# Altium schematic sheet jmb575.SchDoc
size A2; SheetNumber: 3; SheetTotal: 4
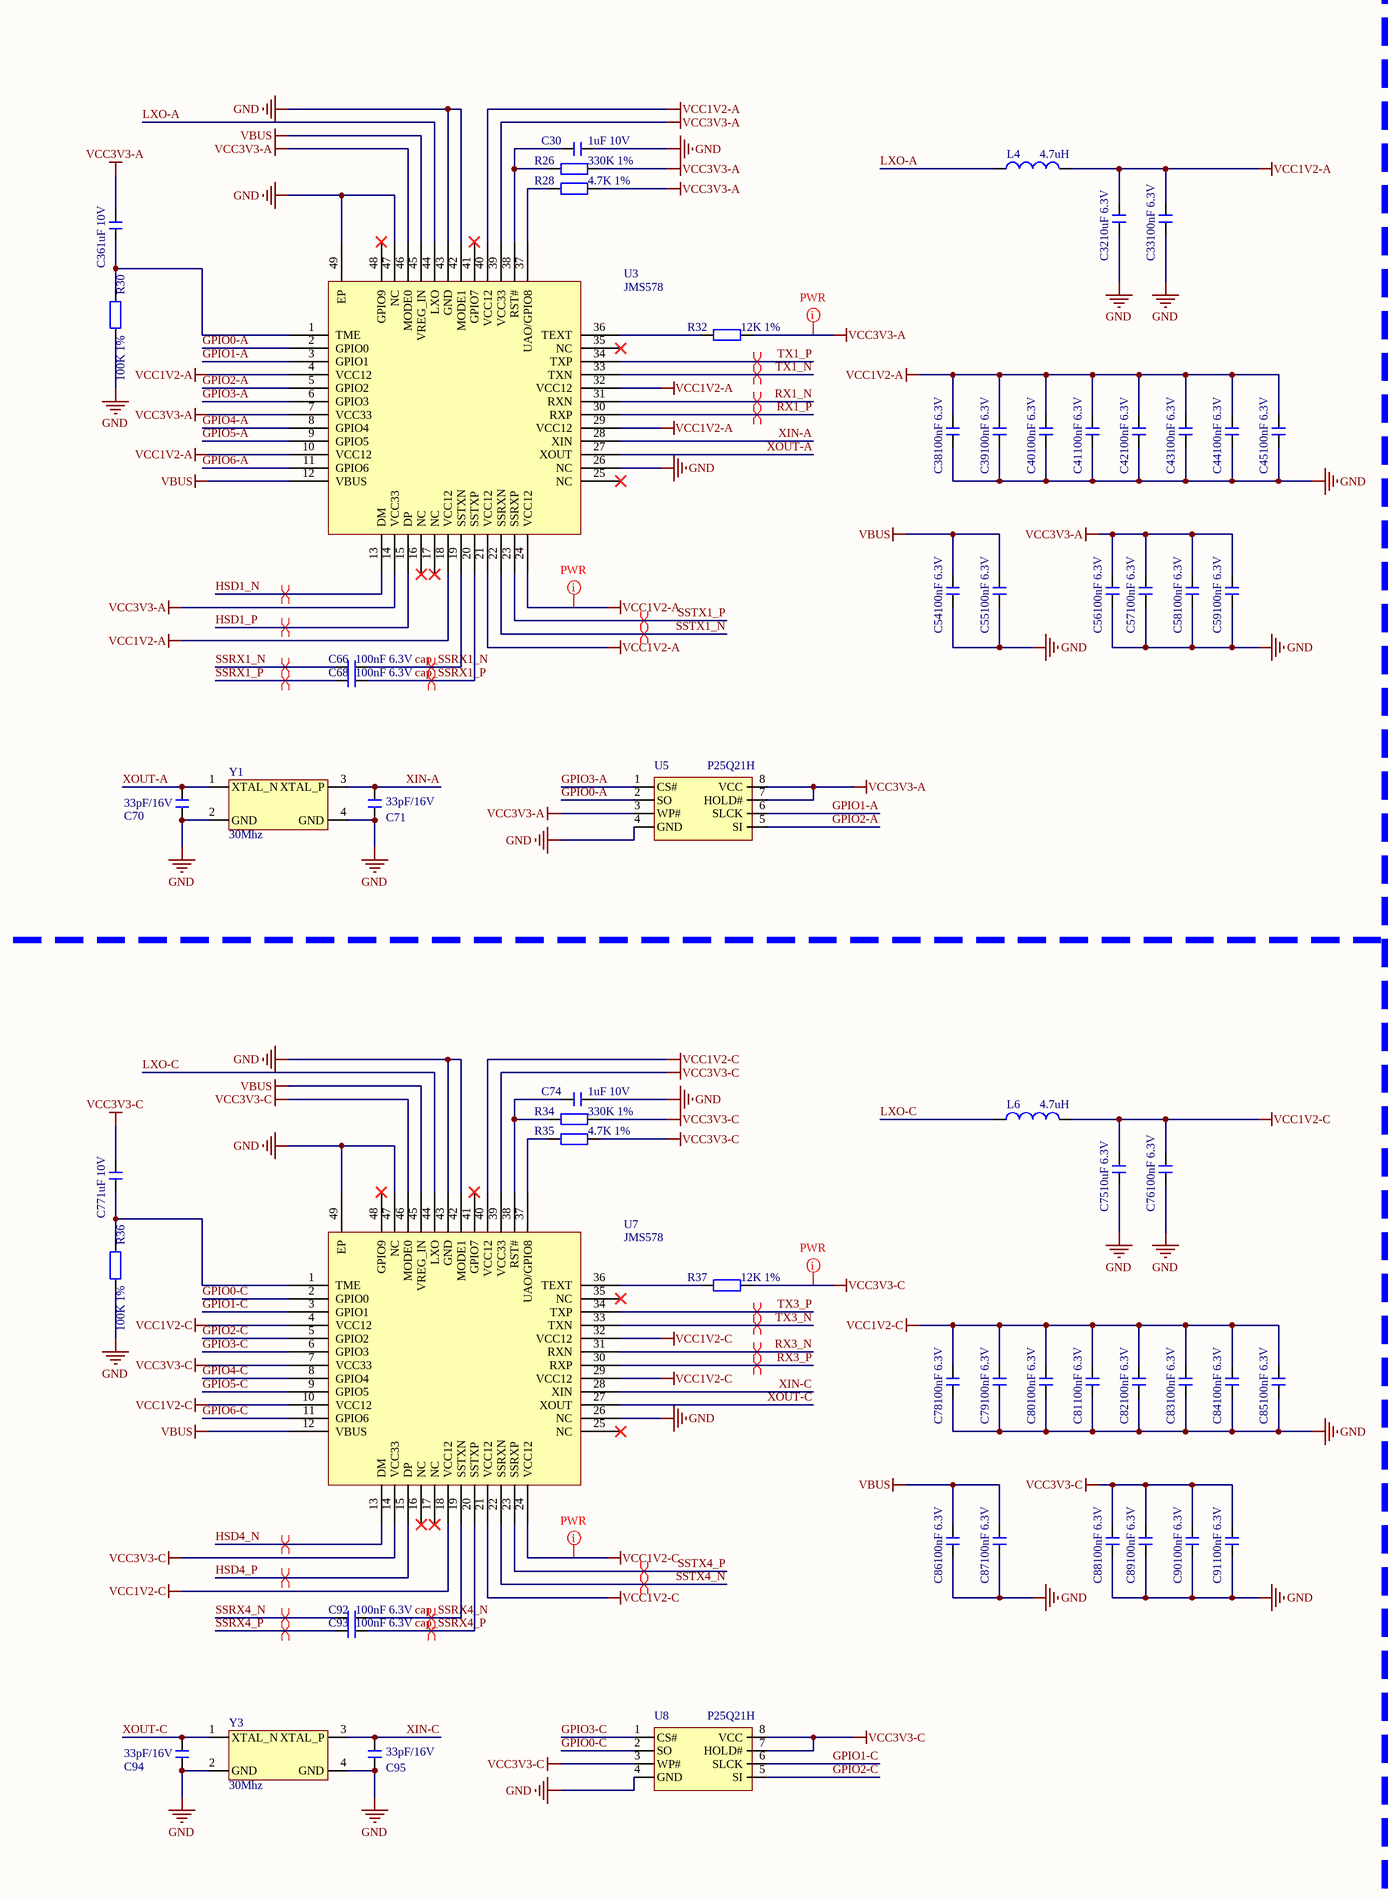
[diagram p0: jmb575.SchDoc, left]
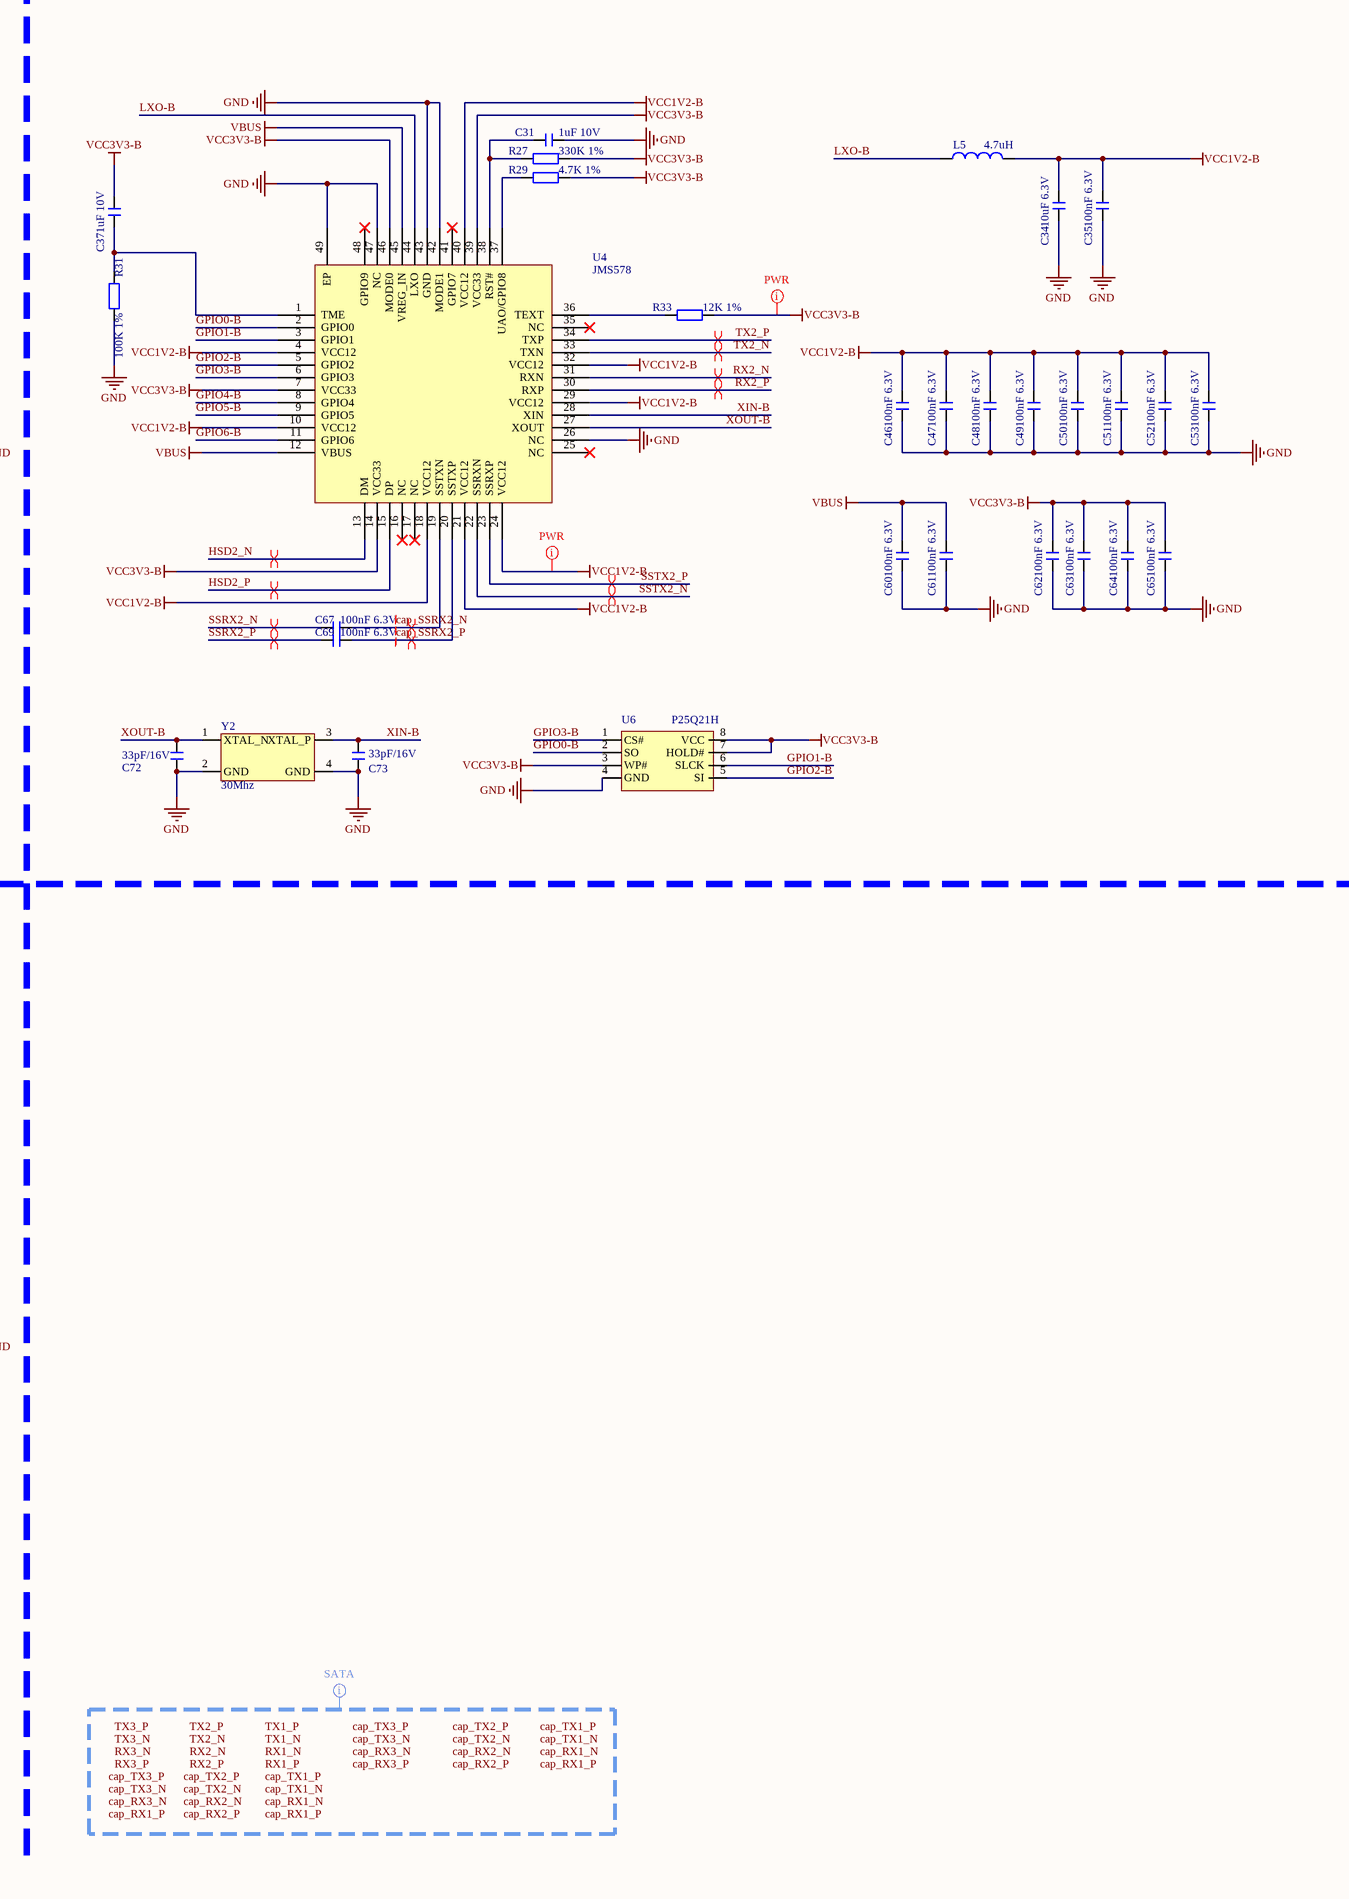
[diagram p1: jmb575.SchDoc, right]

## Parts
C30  1uF 10V  [C0402_L]
C31  1uF 10V  [C0402_L]
C32  10uF 6.3V  [C0603_L]
C33  100nF 6.3V  [C0402_L]
C34  10uF 6.3V  [C0603_L]
C35  100nF 6.3V  [C0402_L]
C36  1uF 10V  [C0402_L]
C37  1uF 10V  [C0402_L]
C38  100nF 6.3V  [C0402_L]
C39  100nF 6.3V  [C0402_L]
C40  100nF 6.3V  [C0402_L]
C41  100nF 6.3V  [C0402_L]
C42  100nF 6.3V  [C0402_L]
C43  100nF 6.3V  [C0402_L]
C44  100nF 6.3V  [C0402_L]
C45  100nF 6.3V  [C0402_L]
C46  100nF 6.3V  [C0402_L]
C47  100nF 6.3V  [C0402_L]
C48  100nF 6.3V  [C0402_L]
C49  100nF 6.3V  [C0402_L]
C50  100nF 6.3V  [C0402_L]
C51  100nF 6.3V  [C0402_L]
C52  100nF 6.3V  [C0402_L]
C53  100nF 6.3V  [C0402_L]
C54  100nF 6.3V  [C0402_L]
C55  100nF 6.3V  [C0402_L]
C56  100nF 6.3V  [C0402_L]
C57  100nF 6.3V  [C0402_L]
C58  100nF 6.3V  [C0402_L]
C59  100nF 6.3V  [C0402_L]
C60  100nF 6.3V  [C0402_L]
C61  100nF 6.3V  [C0402_L]
C62  100nF 6.3V  [C0402_L]
C63  100nF 6.3V  [C0402_L]
C64  100nF 6.3V  [C0402_L]
C65  100nF 6.3V  [C0402_L]
C66  100nF 6.3V  [C0402_L]
C67  100nF 6.3V  [C0402_L]
C68  100nF 6.3V  [C0402_L]
C69  100nF 6.3V  [C0402_L]
C70  33pF/16V  [C0402_L]
C71  33pF/16V  [C0402_L]
C72  33pF/16V  [C0402_L]
C73  33pF/16V  [C0402_L]
C74  1uF 10V  [C0402_L]
C75  10uF 6.3V  [C0603_L]
C76  100nF 6.3V  [C0402_L]
C77  1uF 10V  [C0402_L]
C78  100nF 6.3V  [C0402_L]
C79  100nF 6.3V  [C0402_L]
C80  100nF 6.3V  [C0402_L]
C81  100nF 6.3V  [C0402_L]
C82  100nF 6.3V  [C0402_L]
C83  100nF 6.3V  [C0402_L]
C84  100nF 6.3V  [C0402_L]
C85  100nF 6.3V  [C0402_L]
C86  100nF 6.3V  [C0402_L]
C87  100nF 6.3V  [C0402_L]
C88  100nF 6.3V  [C0402_L]
C89  100nF 6.3V  [C0402_L]
C90  100nF 6.3V  [C0402_L]
C91  100nF 6.3V  [C0402_L]
C92  100nF 6.3V  [C0402_L]
C93  100nF 6.3V  [C0402_L]
C94  33pF/16V  [C0402_L]
C95  33pF/16V  [C0402_L]
L4  4.7uH  [NR2520]
L5  4.7uH  [NR2520]
L6  4.7uH  [NR2520]
R26  330K 1%  [R0402_L]
R27  330K 1%  [R0402_L]
R28  4.7K 1%  [R0402_L]
R29  4.7K 1%  [R0402_L]
R30  100K 1%  [R0402_L]
R31  100K 1%  [R0402_L]
R32  12K 1%  [R0402_L]
R33  12K 1%  [R0402_L]
R34  330K 1%  [R0402_L]
R35  4.7K 1%  [R0402_L]
R36  100K 1%  [R0402_L]
R37  12K 1%  [R0402_L]
U3  JMS578  [QFN48-L6.0-W6.0-P0.4]
U4  JMS578  [QFN48-L6.0-W6.0-P0.4]
U5  P25Q21H  [SOP8_L]
U6  P25Q21H  [SOP8_L]
U7  JMS578  [QFN48-L6.0-W6.0-P0.4]
U8  P25Q21H  [SOP8_L]
Y1  30Mhz  [OSC 3225-4P]
Y2  30Mhz  [OSC 3225-4P]
Y3  30Mhz  [OSC 3225-4P]

## Nets
GND: C30.1 C31.1 C32.1 C33.1 C34.1 C35.1 C38.1 C39.1 C40.1 C41.1 C42.1 C43.1 C44.1 C45.1 C46.1 C47.1 C48.1 C49.1 C50.1 C51.1 C52.1 C53.1 C54.1 C55.1 C56.1 C57.1 C58.1 C59.1 C60.1 C61.1 C62.1 C63.1 C64.1 C65.1 C70.2 C71.2 C72.2 C73.2 C74.1 C75.1 C76.1 C78.1 C79.1 C80.1 C81.1 C82.1 C83.1 C84.1 C85.1 C86.1 C87.1 C88.1 C89.1 C90.1 C91.1 C94.2 C95.2 R30.1 R31.1 R36.1 U3.26(NC) U3.42(MODE1) U3.43(GND) U3.47(NC) U3.49(EP) U4.26(NC) U4.42(MODE1) U4.43(GND) U4.47(NC) U4.49(EP) U5.4(GND) U6.4(GND) U7.26(NC) U7.42(MODE1) U7.43(GND) U7.47(NC) U7.49(EP) U8.4(GND) Y1.2(GND) Y1.4(GND) Y2.2(GND) Y2.4(GND) Y3.2(GND) Y3.4(GND)
VBUS: C54.2 C55.2 C60.2 C61.2 C86.2 C87.2 U3.12(VBUS) U3.45(VREG_IN) U4.12(VBUS) U4.45(VREG_IN) U7.12(VBUS) U7.45(VREG_IN)
VCC1V2-A: C32.2 C33.2 C38.2 C39.2 C40.2 C41.2 C42.2 C43.2 C44.2 C45.2 L4.2 U3.4(VCC12) U3.10(VCC12) U3.18(VCC12) U3.21(VCC12) U3.24(VCC12) U3.29(VCC12) U3.32(VCC12) U3.40(VCC12)
VCC1V2-B: C34.2 C35.2 C46.2 C47.2 C48.2 C49.2 C50.2 C51.2 C52.2 C53.2 L5.2 U4.4(VCC12) U4.10(VCC12) U4.18(VCC12) U4.21(VCC12) U4.24(VCC12) U4.29(VCC12) U4.32(VCC12) U4.40(VCC12)
VCC1V2-C: C75.2 C76.2 C78.2 C79.2 C80.2 C81.2 C82.2 C83.2 C84.2 C85.2 L6.2 U7.4(VCC12) U7.10(VCC12) U7.18(VCC12) U7.21(VCC12) U7.24(VCC12) U7.29(VCC12) U7.32(VCC12) U7.40(VCC12)
VCC3V3-A: C36.2 C56.2 C57.2 C58.2 C59.2 R26.1 R28.1 R32.1 U3.7(VCC33) U3.14(VCC33) U3.39(VCC33) U3.46(MODE0) U5.3(WP#) U5.7(HOLD#) U5.8(VCC)
VCC3V3-B: C37.2 C62.2 C63.2 C64.2 C65.2 R27.1 R29.1 R33.1 U4.7(VCC33) U4.14(VCC33) U4.39(VCC33) U4.46(MODE0) U6.3(WP#) U6.7(HOLD#) U6.8(VCC)
VCC3V3-C: C77.2 C88.2 C89.2 C90.2 C91.2 R34.1 R35.1 R37.1 U7.7(VCC33) U7.14(VCC33) U7.39(VCC33) U7.46(MODE0) U8.3(WP#) U8.7(HOLD#) U8.8(VCC)
cap_SSRX1_N: C66.2 U3.19(SSTXN)
cap_SSRX1_P: C68.2 U3.20(SSTXP)
cap_SSRX2_N: C67.2 U4.19(SSTXN)
cap_SSRX2_P: C69.2 U4.20(SSTXP)
cap_SSRX4_N: C92.2 U7.19(SSTXN)
cap_SSRX4_P: C93.2 U7.20(SSTXP)
GPIO0-A: U3.2(GPIO0) U5.2(SO)
GPIO0-B: U4.2(GPIO0) U6.2(SO)
GPIO0-C: U7.2(GPIO0) U8.2(SO)
GPIO1-A: U3.3(GPIO1) U5.6(SLCK)
GPIO1-B: U4.3(GPIO1) U6.6(SLCK)
GPIO1-C: U7.3(GPIO1) U8.6(SLCK)
GPIO2-A: U3.5(GPIO2) U5.5(SI)
GPIO2-B: U4.5(GPIO2) U6.5(SI)
GPIO2-C: U7.5(GPIO2) U8.5(SI)
GPIO3-A: U3.6(GPIO3) U5.1(CS#)
GPIO3-B: U4.6(GPIO3) U6.1(CS#)
GPIO3-C: U7.6(GPIO3) U8.1(CS#)
GPIO4-A: U3.8(GPIO4)
GPIO4-B: U4.8(GPIO4)
GPIO4-C: U7.8(GPIO4)
GPIO5-A: U3.9(GPIO5)
GPIO5-B: U4.9(GPIO5)
GPIO5-C: U7.9(GPIO5)
GPIO6-A: U3.11(GPIO6)
GPIO6-B: U4.11(GPIO6)
GPIO6-C: U7.11(GPIO6)
HSD1_N: U3.13(DM)
HSD1_P: U3.15(DP)
HSD2_N: U4.13(DM)
HSD2_P: U4.15(DP)
HSD4_N: U7.13(DM)
HSD4_P: U7.15(DP)
LXO-A: L4.1 U3.44(LXO)
LXO-B: L5.1 U4.44(LXO)
LXO-C: L6.1 U7.44(LXO)
RX1_N: U3.31(RXN)
RX1_P: U3.30(RXP)
RX2_N: U4.31(RXN)
RX2_P: U4.30(RXP)
RX3_N: U7.31(RXN)
RX3_P: U7.30(RXP)
SSRX1_N: C66.1
SSRX1_P: C68.1
SSRX2_N: C67.1
SSRX2_P: C69.1
SSRX4_N: C92.1
SSRX4_P: C93.1
SSTX1_N: U3.22(SSRXN)
SSTX1_P: U3.23(SSRXP)
SSTX2_N: U4.22(SSRXN)
SSTX2_P: U4.23(SSRXP)
SSTX4_N: U7.22(SSRXN)
SSTX4_P: U7.23(SSRXP)
TX1_N: U3.33(TXN)
TX1_P: U3.34(TXP)
TX2_N: U4.33(TXN)
TX2_P: U4.34(TXP)
TX3_N: U7.33(TXN)
TX3_P: U7.34(TXP)
XIN-A: C71.1 U3.28(XIN) Y1.3(XTAL_P)
XIN-B: C73.1 U4.28(XIN) Y2.3(XTAL_P)
XIN-C: C95.1 U7.28(XIN) Y3.3(XTAL_P)
XOUT-A: C70.1 U3.27(XOUT) Y1.1(XTAL_N)
XOUT-B: C72.1 U4.27(XOUT) Y2.1(XTAL_N)
XOUT-C: C94.1 U7.27(XOUT) Y3.1(XTAL_N)
NetC30_2: C30.2 R26.2 U3.38(RST#)
NetC31_2: C31.2 R27.2 U4.38(RST#)
NetC36_1: C36.1 R30.2 U3.1(TME)
NetC37_1: C37.1 R31.2 U4.1(TME)
NetC74_2: C74.2 R34.2 U7.38(RST#)
NetC77_1: C77.1 R36.2 U7.1(TME)
NetR28_2: R28.2 U3.37(UAO/GPIO8)
NetR29_2: R29.2 U4.37(UAO/GPIO8)
NetR32_2: R32.2 U3.36(TEXT)
NetR33_2: R33.2 U4.36(TEXT)
NetR35_2: R35.2 U7.37(UAO/GPIO8)
NetR37_2: R37.2 U7.36(TEXT)

Not connected (* = marked no-connect by the designer): U3 16(NC)* 17(NC)* 25(NC)* 35(NC)* 41(GPIO7)* 48(GPIO9)*; U4 16(NC)* 17(NC)* 25(NC)* 35(NC)* 41(GPIO7)* 48(GPIO9)*; U7 16(NC)* 17(NC)* 25(NC)* 35(NC)* 41(GPIO7)* 48(GPIO9)*

## Layout directives
differential pair: cap_SSRX1_N, cap_SSRX1_P, cap_SSRX2_N, cap_SSRX2_P, cap_SSRX4_N, cap_SSRX4_P, HSD1_N, HSD1_P, HSD2_N, HSD2_P, HSD4_N, HSD4_P, RX1_N, RX1_P, RX2_N, RX2_P, RX3_N, RX3_P, SSRX1_N, SSRX1_P, SSRX2_N, SSRX2_P, SSRX4_N, SSRX4_P, SSTX1_N, SSTX1_P, SSTX2_N, SSTX2_P, SSTX4_N, SSTX4_P, TX1_N, TX1_P, TX2_N, TX2_P, TX3_N, TX3_P
net class PWR: VCC1V2-A, VCC1V2-B, VCC1V2-C, VCC3V3-A, VCC3V3-B, VCC3V3-C
net class SATA; rule Differential Pairs Routing [Pref Gap = 6mil    Min Gap  = 6mil    Max Gap  = 6milPref Width = 4.29mil    Min Width  = 4.29mil    Max Width  = 4.29mil]; rule Routing Via Style [Pref Size = 0.4mm    Pref Hole Size = 0.3mm]: cap_RX1_N, cap_RX1_P, cap_RX2_N, cap_RX2_P, cap_RX3_N, cap_RX3_P, cap_TX1_N, cap_TX1_P, cap_TX2_N, cap_TX2_P, cap_TX3_N, cap_TX3_P, RX1_N, RX1_P, RX2_N, RX2_P, RX3_N, RX3_P, TX1_N, TX1_P, TX2_N, TX2_P, TX3_N, TX3_P

## Notes on the sheet
- Labels drawn without touching a wire or pin: cap_RX1_N, cap_RX1_P, cap_RX2_N, cap_RX2_P, cap_RX3_N, cap_RX3_P, cap_TX1_N, cap_TX1_P, cap_TX2_N, cap_TX2_P, cap_TX3_N, cap_TX3_P, RX1_N, RX1_P, RX2_N, RX2_P, RX3_N, RX3_P, TX1_N, TX1_P, TX2_N, TX2_P, TX3_N, TX3_P

## Library data of the parts
C30-C95 = C: 无极性贴片电容; 版权归属: 源创客; 材质: X7R; BOM名称: 无极性贴片电容; 学习资源: www.ooocke.com
L4-L6 = L: 小功率贴片电感; 版权归属: 源创客; BOM名称: 小功率贴片电感; 学习资源: www.ooocke.com
R26-R37 = R: 贴片电阻; 版权归属: 源创客; BOM名称: 贴片电阻; 学习资源: www.ooocke.com
U5 U6 U8 = P25D40H
Y1-Y3 = Crystal